# Altium project lab2_vodorezov_buck.PrjPcb
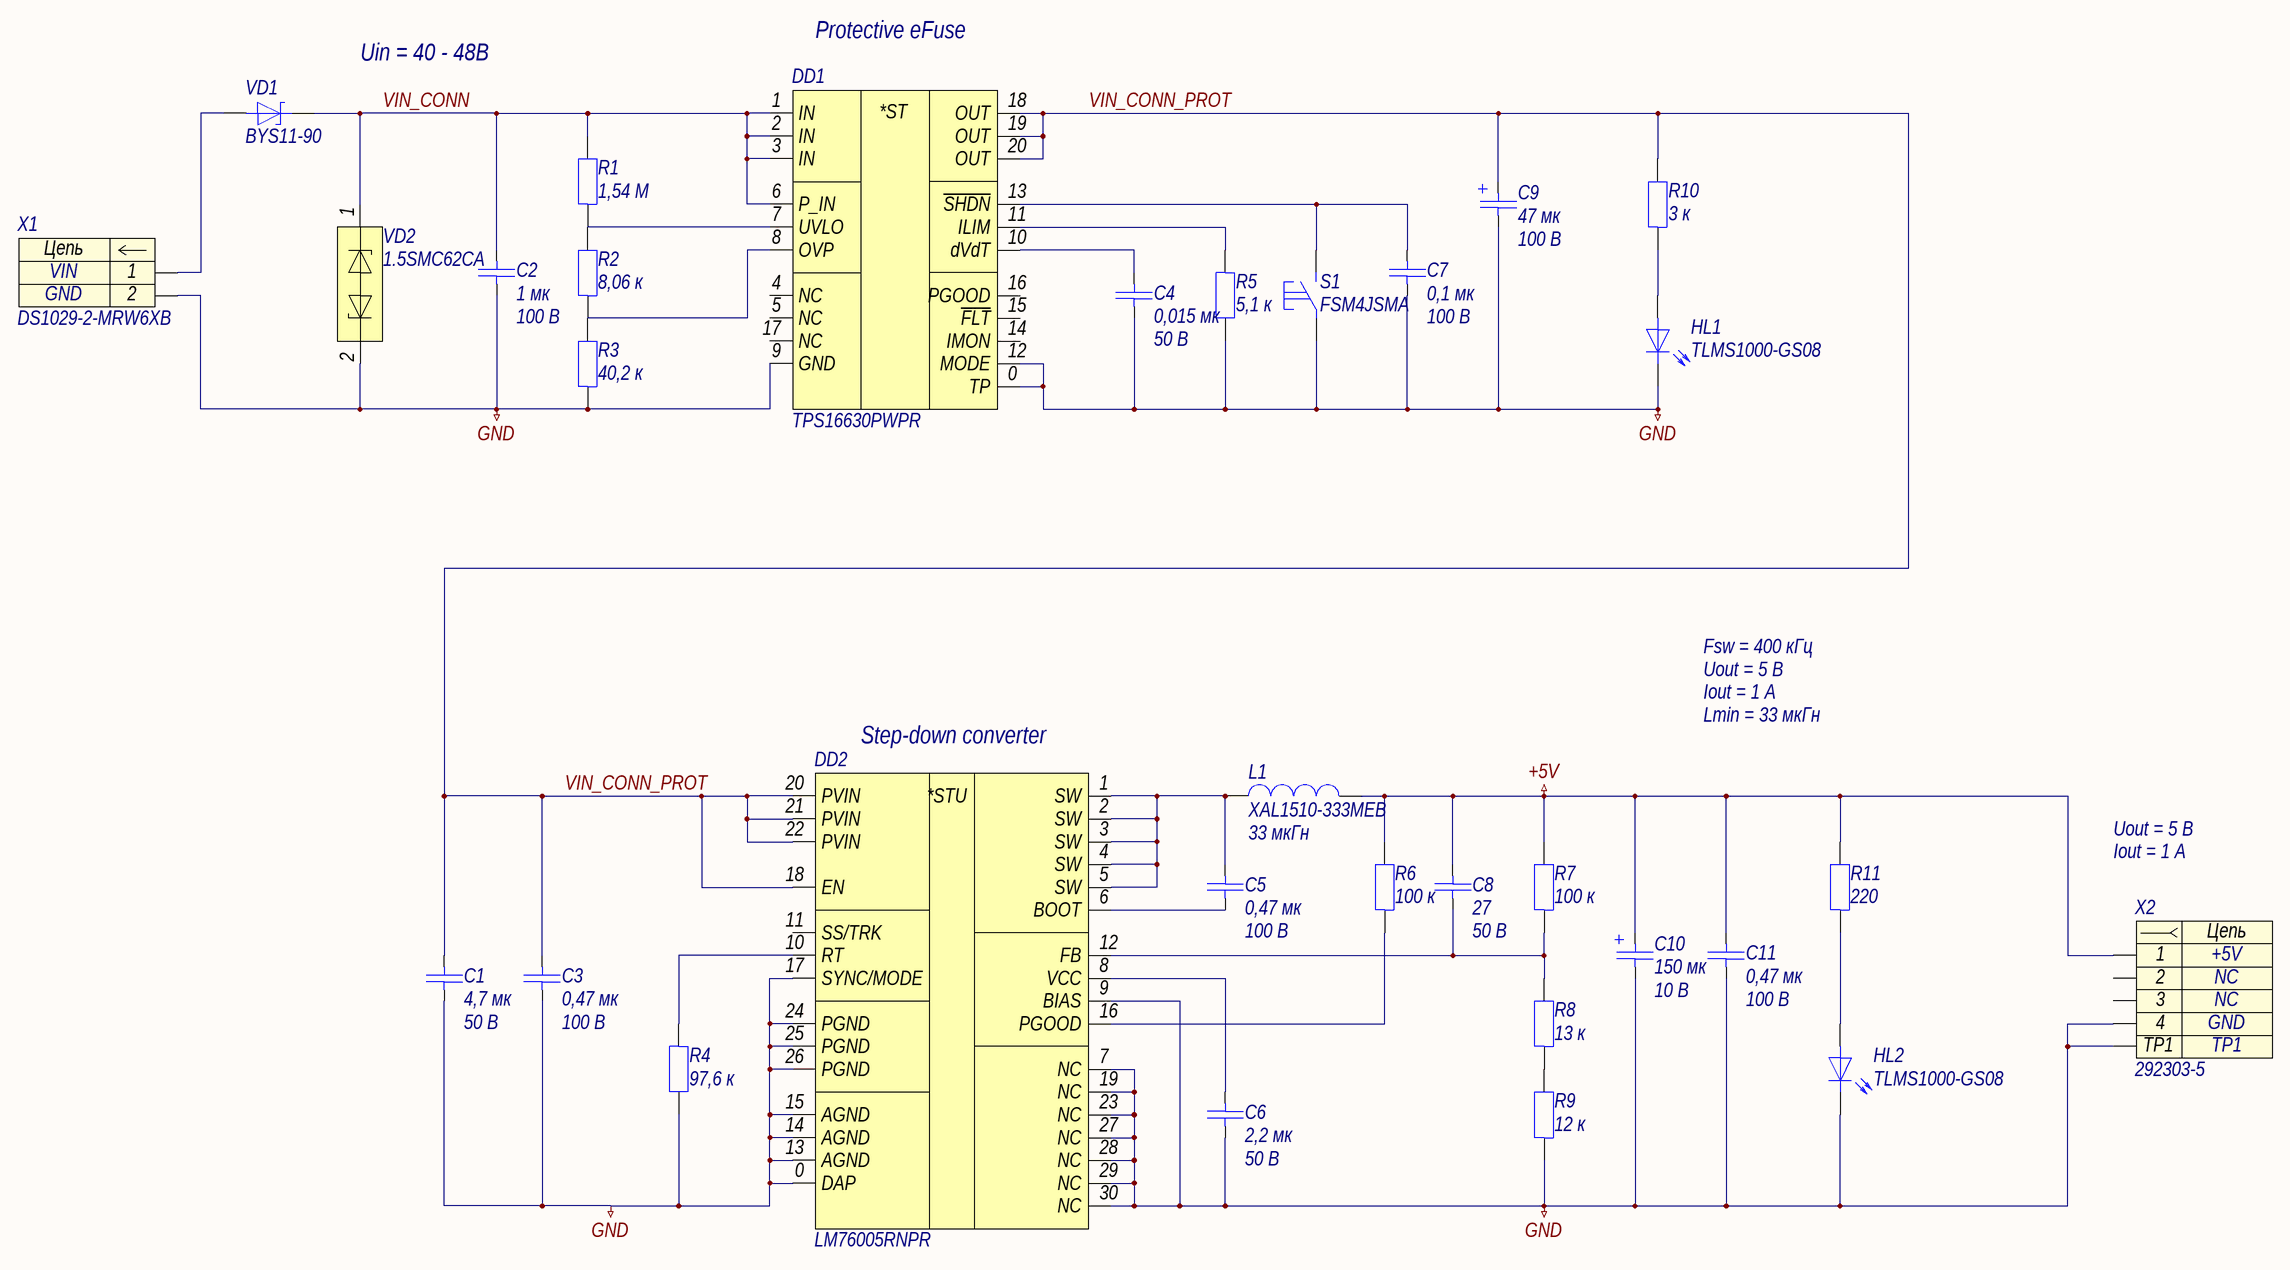
[diagram p0: lab2_vodorezov_buck.SchDoc]
approver: Капустин; check: Капустин; designation: СПБПУ.331506.002; developer: Водорезов; document_code: Ý3; document_type: Схема электрическая принципиальная; pcb_dec_number: СПБПУ 331506.002; project: Понижающий преобразователь; sheets_total: 1; title: Понижающий преобразователь; title_line_1: Понижающий; title_line_2: преобразователь
1 sheet, 32 parts. Net scope: global (net labels, ports and power ports of the same name join across sheets).
Board file: lab2_vodorezov_buck.PcbDoc

## Sheet lab2_vodorezov_buck.SchDoc: Понижающий преобразователь
size 594 x 420 mm; ApprovedBy: Капустин; CheckedBy: Капустин; DrawnBy: Водорезов; DocumentNumber: СПБПУ.331506.002Ý3; SheetNumber: n; SheetTotal: 1; DocumentCode: Ý3; ImagePath: СПБПУ 331506.002

### Parts
C1  4,7 мк  Напряжение: 50 В  [C1206]
C2  1 мк  Напряжение: 100 В  [C1206]
C3  0,47 мк  Напряжение: 100 В  [C1206]
C4  0,015 мк  Напряжение: 50 В  [C0603]
C5  0,47 мк  Напряжение: 100 В  [C1206]
C6  2,2 мк  Напряжение: 50 В  [C0603]
C7  0,1 мк  Напряжение: 100 В  [C0603]
C8  27  Напряжение: 50 В  [C0402]
C9  47 мк  Напряжение: 100 В  [CAPAE-1000X1000X1200]
C10  150 мк  Напряжение: 10 В  [CAPAE-660X660X580]
C11  0,47 мк  Напряжение: 100 В  [C1206]
DD1  TPS16630PWPR  [HTSSOP-20]
DD2  LM76005RNPR  [WQFN-30]
HL1  TLMS1000-GS08  [HL0603]
HL2  TLMS1000-GS08  [HL0603]
L1  XAL1510-333MEB  Индуктивность: 33 мкГн  [XAL-2-1620X1520X1100]
R1  1,54 М  [R0603]
R2  8,06 к  [R0603]
R3  40,2 к  [R0603]
R4  97,6 к  [R0603]
R5  5,1 к  [R0603]
R6  100 к  [R0603]
R7  100 к  [R0603]
R8  13 к  [R0603]
R9  12 к  [R0603]
R10  3 к  [R0603]
R11  220  [R0603]
S1  FSM4JSMA  [FSM4JSMA]
VD1  BYS11-90  [DO-214AC]
VD2  1.5SMC62CA  [DO-214AB]
X1  DS1029-2-MRW6XB  [DS1029-2-MRW6XB]
X2  292303-5  [292303-5]

### Nets
+5V: C8.2 C10.1 C11.1 L1.2 R6.2 R7.2 R11.2 X2.1
GND: C1.2 C2.2 C3.2 C4.2 C6.1 C7.2 C9.2 C10.2 C11.2 DD1.0(TP) DD1.9(GND) DD1.12(MODE) DD2.0(DAP) DD2.7(NC) DD2.9(BIAS) DD2.13(AGND) DD2.14(AGND) DD2.15(AGND) DD2.17(SYNC/MODE) DD2.19(NC) DD2.23(NC) DD2.24(PGND) DD2.25(PGND) DD2.26(PGND) DD2.27(NC) DD2.28(NC) DD2.29(NC) DD2.30(NC) HL1.1 HL2.1 R3.1 R4.2 R5.2 R9.1 S1.1 VD2.2 X1.2 X2.4 X2.TP1
VIN_CONN: C2.1 DD1.1(IN) DD1.2(IN) DD1.3(IN) DD1.6(P_IN) R1.2 VD1.1 VD2.1
VIN_CONN_PROT: C1.1 C3.1 C9.1 DD1.18(OUT) DD1.19(OUT) DD1.20(OUT) DD2.18(EN) DD2.20(PVIN) DD2.21(PVIN) DD2.22(PVIN) R10.2
NetC4_1: C4.1 DD1.10(dVdT)
NetC5_1: C5.1 DD2.6(BOOT)
NetC5_2: C5.2 DD2.1(SW) DD2.2(SW) DD2.3(SW) DD2.4(SW) DD2.5(SW) L1.1
NetC6_2: C6.2 DD2.8(VCC)
NetC7_1: C7.1 DD1.13(~{SHDN}) S1.2
NetC8_1: C8.1 DD2.12(FB) R7.1 R8.2
NetDD1_7: DD1.7(UVLO) R1.1 R2.2
NetDD1_8: DD1.8(OVP) R2.1 R3.2
NetDD1_11: DD1.11(ILIM) R5.1
NetDD2_10: DD2.10(RT) R4.1
NetDD2_16: DD2.16(PGOOD) R6.1
NetHL1_2: HL1.2 R10.1
NetHL2_2: HL2.2 R11.1
NetR8_1: R8.1 R9.2
NetVD1_2: VD1.2 X1.1

Not connected (* = marked no-connect by the designer): DD1 4(NC) 5(NC) 14(IMON) 15(~{FLT}) 16(PGOOD) 17(NC); DD2 11(SS/TRK); X2 2 3

### Notes on the sheet
- Protective eFuse
- Uin = 40 - 48В
- Fsw = 400 кГц
- Uout = 5 В
- Iout = 1 А
- Lmin = 33 мкГн
- (near DD2) Step-down converter
- Перв. примен.
- Справ. №
- Подп. и дата
- Инв. № дубл.
- Нормоконтроль:
- Взам. инв. №
- Изм.
- Лист
- № докум.
- Подп.
- Дата
- Лит.
- Масса
- Масштаб
- Т.контр.
- Пров.
- Разраб.
- Листов
- Разработал:
- Инв. № подл.
- Н.контр.
- Утв.
- Копировал
- Формат
- А2
- (in symbol dd0002) *ST
- (in symbol dd0004) *STU
- (in symbol x0003) Цепь
- (in symbol x0006) Цепь

### Library data of the parts
C1 = c0087: =Описание; ID: c0087; Фамилия: Паньков; Описание: Конденсатор чип 1206 4,7 мкФ 50 В ±10 %; Наименование: CC1206KRX7R9BB475; Производитель: YAGEO Corp.; Отклонение: ±10 %; Рабочие температуры: от –55 °С до +125 °С; Температурный коэффициент емкости: X7R; Корпус: 1206; Номинал: 4,7 мк; Номинальное напряжение: 50 В; HelpURL: https://www.yageo.com/upload/media/product/productsearch/datasheet/mlcc/UPY-GPHC_X7R_6.3V-to-50V_20.pdf
C2 = c0068: =Описание; ID: c0068; Фамилия: Ларионов; Описание: Конденсатор чип 1206 1 мкФ 100 В ±10 %; Наименование: CC1206KKX7R0BB105; Производитель: YAGEO Corp.; Отклонение: ±10 %; Рабочие температуры: от –55 °С до +125 °С; Температурный коэффициент емкости: X7R; Корпус: 1206; Номинал: 1 мк; Номинальное напряжение: 100 В; HelpURL: https://www.yageo.com/upload/media/product/productsearch/datasheet/mlcc/UPY-NP0X7R_MV_100-to-630V_22.pdf
C3 C5 C11 = c0008: =Описание; ID: c0008; Фамилия: Водорезов; Описание: Конденсатор чип 1206 470 нФ 100 В ±10 %; Наименование: CL31B474KCHWPNE; Производитель: Samsung electro-mechanics; Отклонение: ±10 %; Рабочие температуры: от –55 °С до +125 °С; Температурный коэффициент емкости: X7R; Корпус: 1206; Номинал: 0,47 мк; Номинальное напряжение: 100 В; HelpURL: http://product.samsungsem.com/mlcc/CL31B474KCHWPN.do
C4 = c0023: =Описание; ID: c0023; Фамилия: Жернаков; Описание: Конденсатор чип 0603 15 нФ 50 В ±5 %; Наименование: CC0603JPX7R9BB153; Производитель: YAGEO Corp.; Отклонение: ±5 %; Рабочие температуры: от –55 °С до +125 °С; Температурный коэффициент емкости: X7R; Корпус: 0603; Номинал: 0,015 мк; Номинальное напряжение: 50 В; HelpURL: https://www.yageo.com/upload/media/product/productsearch/datasheet/mlcc/UPY-GPHC_X7R_6.3V-to-50V_20.pdf
C6 = c0073: =Описание; ID: c0073; Фамилия: Самарин; Описание: Конденсатор чип 0603 2,2 мкФ 50 В ±10 %; Наименование: CC0603KRX5R9BB225; Производитель: YAGEO Corp.; Отклонение: ±10 %; Рабочие температуры: от –55 °С до +85 °С; Температурный коэффициент емкости: X5R; Корпус: 0603; Номинал: 2,2 мк; Номинальное напряжение: 50 В; HelpURL: https://www.yageo.com/upload/media/product/productsearch/datasheet/mlcc/UPY-GPHC_X5R_4V-to-50V_26.pdf
C7 = c0018: =Описание; ID: c0018; Фамилия: Ларионов; Описание: Конденсатор чип 0603 0,1 мкФ 100 В ±10 %; Наименование: CC0603KRX7R0BB104; Производитель: YAGEO Corp.; Отклонение: ±10 %; Рабочие температуры: от -55 °С до +125 °С; Корпус: 0603; Номинал: 0,1 мк; Номинальное напряжение: 100 В; HelpURL: https://www.yageo.com/upload/media/product/productsearch/datasheet/mlcc/UPY-NP0X7R_MV_100-to-630V_22.pdf
C8 = c0001: =Описание; ID: c0001; Фамилия: Соколов; Описание: Конденсатор чип 0402 27 пФ 50 В ±5 %; Наименование: CL05C270JB5NNNC; Производитель: Samsung electro-mechanics; Отклонение: ±5 %; Рабочие температуры: от –55 °С до +125 °С; Температурный коэффициент емкости: C0G; Корпус: 0402; Номинал: 27; Номинальное напряжение: 50 В; HelpURL: http://product.samsungsem.com/mlcc/CL05C270JB5NNN.do
C9 = c0118: =Описание; ID: c0118; Фамилия: Ларионов; Описание: Конденсатор электролитический 47 мкФ 100 В ±20 %; Наименование: MAL214699904E3; Производитель: Vishay Intertechnology, Inc.; Отклонение: ±20 %; Рабочие температуры: от –55 °С до +125 °С; Корпус: CAPAE (10 x 10 x 12); Номинал: 47 мк; Номинальное напряжение: 100 В; Температурный коэффициент емкости: -; HelpURL: https://www.vishay.com/capacitors/list/product-28403/
C10 = c0120: =Описание; ID: c0120; Фамилия: Водорезов; Описание: Конденсатор электролитический 150 мкФ 10 В ±20 %; Наименование: EEEFK1A151AL; Производитель: Panasonic Corporation; Отклонение: ±20 %; Рабочие температуры: от –55 °С до +105 °С; Корпус: CAPAE (6,6 x 6,6 x 5,8); Номинал: 150 мк; Номинальное напряжение: 10 В; HelpURL: https://industrial.panasonic.com/ww/products/capacitors/aluminum-capacitors/aluminum-cap-smd/models/EEEFK1A151AL; Температурный коэффициент емкости: -
DD1 = dd0002: =Описание; ID: dd0002; Фамилия: Жернаков; Описание: Защитная микросхема eFuse 60 В и 6 А; Производитель: Texas Instruments; Напряжение: от 4,5 В до 60 В; Максимальное напряжение: 67 В; Ток: от 0,6 А до 6 А; Рабочие температуры: от -40 °С до +125 °С; Наименование: TPS16630PWPR; Корпус: HTSSOP-20; HelpURL: https://www.ti.com/product/TPS1663
DD2 = dd0004: =Описание; ID: dd0004; Фамилия: Водорезов; Описание: Понижающий преобразователь напряжения 60 В и 5 А; Производитель: Texas Instruments; Входное напряжение: от 3,5 В до 60 В; Выходное напряжение: от 1 В до 57 В; Коммутируемый ток: от 0 А до 5 А; Частота переключения: от 200 кГц до 500 КГц; Рабочие температуры: от -40 °С до +125 °С; Наименование: LM76005RNPR; Корпус: WQFN-30; HelpURL: https://www.ti.com/product/LM76005
HL1 HL2 = hl0001: =Описание; ID: hl0001; Фамилия: Ларионов; Описание: Светодиод чип 0603 красный; Производитель: Vishay Intertechnology, Inc.; Цвет: Red; Номинальная сила света: 4 мкд; Номинальная длина волны: 628 нм; Номинальный прямой ток: 15 мА; Номинальное падение напряжения: 1,8 В; Рассеиваемая мощность: 40 мВт; Рабочие температуры: от -40 °С до +100 °С; Корпус: 0603; Наименование: TLMS1000-GS08; HelpURL: https://www.vishay.com/leds/list/product-83172/
L1 = l0002: =Описание; ID: l0002; Фамилия: Водорезов; Описание: Катушка индуктивности 33 мкГн ±20 %; Производитель: Coilcraft Inc.; Отклонение: ±20 %; Номинальное активное сопротивление: 18,7 мОм; Максимальное активное сопротивление: 20 мОм; Резонансная частота: 5,8 МГц; Номинальный ток (при нагреве на 20 °С/40 °С): 8,6 А; Ток насыщения: 16,7 А; Рабочее напряжение: от 0 В до 60 В; Рабочие температуры: от –40 °С до +125 °С; Корпус: 16,2 x 15,2 x 11; Наименование: XAL1510-333MEB; Номинал: 33 мкГн; HelpURL: https://www.coilcraft.com/en-us/products/power/shielded-inductors/molded-inductor/xal/xal1510
R1 = r0042: =Описание; ID: r0042; Фамилия: Жернаков; Описание: Резистор чип 0603 1,54 МОм ±1 % 0,1 Вт; Наименование: RC0603FR-071M54L; Производитель: YAGEO Corp.; Отклонение: ±1 %; Номинальное напряжение: 75 В; Рабочие температуры: от -55 °С до +155 °С; Номинальный ток: 1 А; Корпус: 0603; Номинал: 1,54 М; HelpURL: https://www.yageo.com/upload/media/product/productsearch/datasheet/rchip/PYu-RC_Group_51_RoHS_L_11.pdf
R2 = r0020: =Описание; ID: r0020; Фамилия: Жернаков; Описание: Резистор чип 0603 8,06 кОм ±1 % 0,1 Вт; Наименование: RC0603FR-078K06L; Производитель: YAGEO Corp.; Отклонение: ±1 %; Номинальное напряжение: 75 В; Рабочие температуры: от -55 °С до +155 °С; Номинальный ток: 1 А; Корпус: 0603; Номинал: 8,06 к; HelpURL: https://www.yageo.com/upload/media/product/productsearch/datasheet/rchip/PYu-RC_Group_51_RoHS_L_11.pdf
R3 = r0028: =Описание; ID: r0028; Фамилия: Жернаков; Описание: Резистор чип 0603 40,2 кОм ±1 % 0,1 Вт; Наименование: RC0603FR-0740K2L; Производитель: YAGEO Corp.; Отклонение: ±1 %; Номинальное напряжение: 75 В; Рабочие температуры: от -55 °С до +155 °С; Номинальный ток: 1 А; Корпус: 0603; Номинал: 40,2 к; HelpURL: https://www.yageo.com/upload/media/product/productsearch/datasheet/rchip/PYu-RC_Group_51_RoHS_L_11.pdf
R4 = r0024: =Описание; ID: r0024; Фамилия: Водорезов; Описание: Резистор чип 0603 97.6 кОм ±1 % 0,2 Вт; Наименование: RC0603FR-0797K6L; Производитель: YAGEO Corp.; Отклонение: ±1 %; Номинальное напряжение: 75 В; Рабочие температуры: от -55 °С до +155 °С; Номинальный ток: 1 А; Корпус: 0603; Номинал: 97,6 к; HelpURL: https://www.yageo.com/upload/media/product/productsearch/datasheet/rchip/PYu-RC_Group_51_RoHS_L_11.pdf
R5 = r0019: =Описание; ID: r0019; Фамилия: Жернаков; Описание: Резистор чип 0603 5,1 кОм ±1 % 0,1 Вт; Наименование: RC0603FR-075K1L; Производитель: YAGEO Corp.; Отклонение: ±1 %; Номинальное напряжение: 75 В; Рабочие температуры: от -55 °С до +155 °С; Номинальный ток: 1 А; Корпус: 0603; Номинал: 5,1 к; HelpURL: https://www.yageo.com/upload/media/product/productsearch/datasheet/rchip/PYu-RC_Group_51_RoHS_L_11.pdf
R6 R7 = r0023: =Описание; ID: r0023; Фамилия: Водорезов; Описание: Резистор чип 0603 100 кОм ±1 % 0,2 Вт; Наименование: RC0603FR-07100KL; Производитель: YAGEO Corp.; Отклонение: ±1 %; Номинальное напряжение: 75 В; Рабочие температуры: от -55 °С до +155 °С; Номинальный ток: 1 А; Корпус: 0603; Номинал: 100 к; HelpURL: https://www.yageo.com/upload/media/product/productsearch/datasheet/rchip/PYu-RC_Group_51_RoHS_L_11.pdf
R8 = r0016: =Описание; ID: r0016; Фамилия: Жернаков; Описание: Резистор чип 0603 13 кОм ±1 % 0,1 Вт; Наименование: RC0603FR-0713KL; Производитель: YAGEO Corp.; Отклонение: ±1 %; Номинальное напряжение: 75 В; Рабочие температуры: от -55 °С до +155 °С; Номинальный ток: 1 А; Корпус: 0603; Номинал: 13 к; HelpURL: https://www.yageo.com/upload/media/product/productsearch/datasheet/rchip/PYu-RC_Group_51_RoHS_L_11.pdf
R9 = r0015: =Описание; ID: r0015; Фамилия: Соколов; Описание: Резистор чип 0603 12 кОм ±1 % 0,1 Вт; Наименование: AC0603FR-1012KL; Производитель: YAGEO Corp.; Отклонение: ±1 %; Номинальное напряжение: 75 В; Рабочие температуры: от -55 °С до +155 °С; Номинальный ток: 1 А; Корпус: 0603; Номинал: 12 к; HelpURL: https://www.yageo.com/upload/media/product/productsearch/datasheet/rchip/PYu-AC_51_RoHS_L_7.pdf
R10 = r0015: =Описание; ID: r0015; Фамилия: Ларионов; Описание: Резистор чип 0603 3 кОм ±1 % 0,1 Вт; Наименование: RC0603FR-073KL; Производитель: YAGEO Corp.; Отклонение: ±1 %; Номинальное напряжение: 75 В; Рабочие температуры: от -55 °С до +155 °С; Номинальный ток: 1 А; Корпус: 0603; Номинал: 3 к; HelpURL: https://www.yageo.com/upload/media/product/productsearch/datasheet/rchip/PYu-RC_Group_51_RoHS_L_11.pdf
R11 = r0009: =Описание; ID: r0009; Фамилия: Ларионов; Описание: Резистор чип 0603 220 Ом ±1 % 0,1 Вт; Наименование: RC0603FR-07220RL; Производитель: YAGEO Corp.; Отклонение: ±1 %; Номинальное напряжение: 75 В; Рабочие температуры: от -55 °С до +155 °С; Номинальный ток: 1 А; Корпус: 0603; Номинал: 220; HelpURL: https://www.yageo.com/upload/media/product/productsearch/datasheet/rchip/PYu-RC_Group_51_RoHS_L_11.pdf
S1 = sw0002: =Описание; ID: sw0002; Фамилия: Паньков; Описание: Тактовая кнопка поверхностного монтажа; Производитель: TE Connectivity; Ток нагрузки: 50 мА @ 24 В; Сопротивление контакта: 100 мОм; Количество контактов: 1; Рабочие температуры: от -35 °С до +85 °С; Промывка: Разрешена; Корпус: 6,00x6,00x4,98; Наименование: FSM4JSMA; HelpURL: https://www.te.com/usa-en/product-4-1437565-1.html
VD1 = vd0005: =Описание; ID: vd0005; Фамилия: Водорезов; Описание: Диод Шоттки 90 В 1,5 А; Производитель: Vishay Intertechnology, Inc.; Пиковое прямое напряжение: 0,75 В; Импульсное обратное напряжение: 90 В; Макс допустимый средний прямой ток: 1,5 А; Рабочие температуры: от -55 °С до +125 °С; Наименование: BYS11-90; Корпус: DO-214AC
VD2 = vd0004: =Описание; ID: vd0004; Фамилия: Ларионов; Описание: Двунаправленная диодная сборка для подавления помех, 53 В; Производитель: Littelfuse, Inc.; Наименование: 1.5SMC62CA; Корпус: DO-214AB; HelpURL: https://www.littelfuse.com/products/tvs-diodes/surface-mount/1_5smc.aspx
X1 = x0006: =Описание; Contact_1: VIN; Contact_2: GND; ID: x0006; Фамилия: Ларионов; Описание: CWF 2 pin Type B 2,5 мм вилка угловой; Производитель: Connfly Electronic Co. LTD.; Наименование: DS1029-2-MRW6XB; HelpURL: http://www.connfly.com/productshow.aspx?id=352
X2 = x0003: =Описание; Contact_1: +5V; Contact_2: NC; Contact_4: GND; ID: x0003; Фамилия: Ларионов; Описание: USB 2.0 Type A гнездо; Производитель: TE Connectivity; Contact_3: NC; Наименование: 292303-5; HelpURL: https://www.te.com/usa-en/product-292303-5.html